# Altium schematic sheet LPCB235 - RM48 - OVERVIEW.SchDoc
size A3; Address1: Unit 4; DocumentNumber: 21; Revision: 2; SheetNumber: 21; SheetTotal: 37; Lockie__PCB_SUB_ASSEMBLY: CPU Overview; Lockie__PCB_ASSEMBLY: FCU PCB; Lockie__LDL: LPCB235; Lockie__PCB_DESCRIPTION: Flight Control Unit
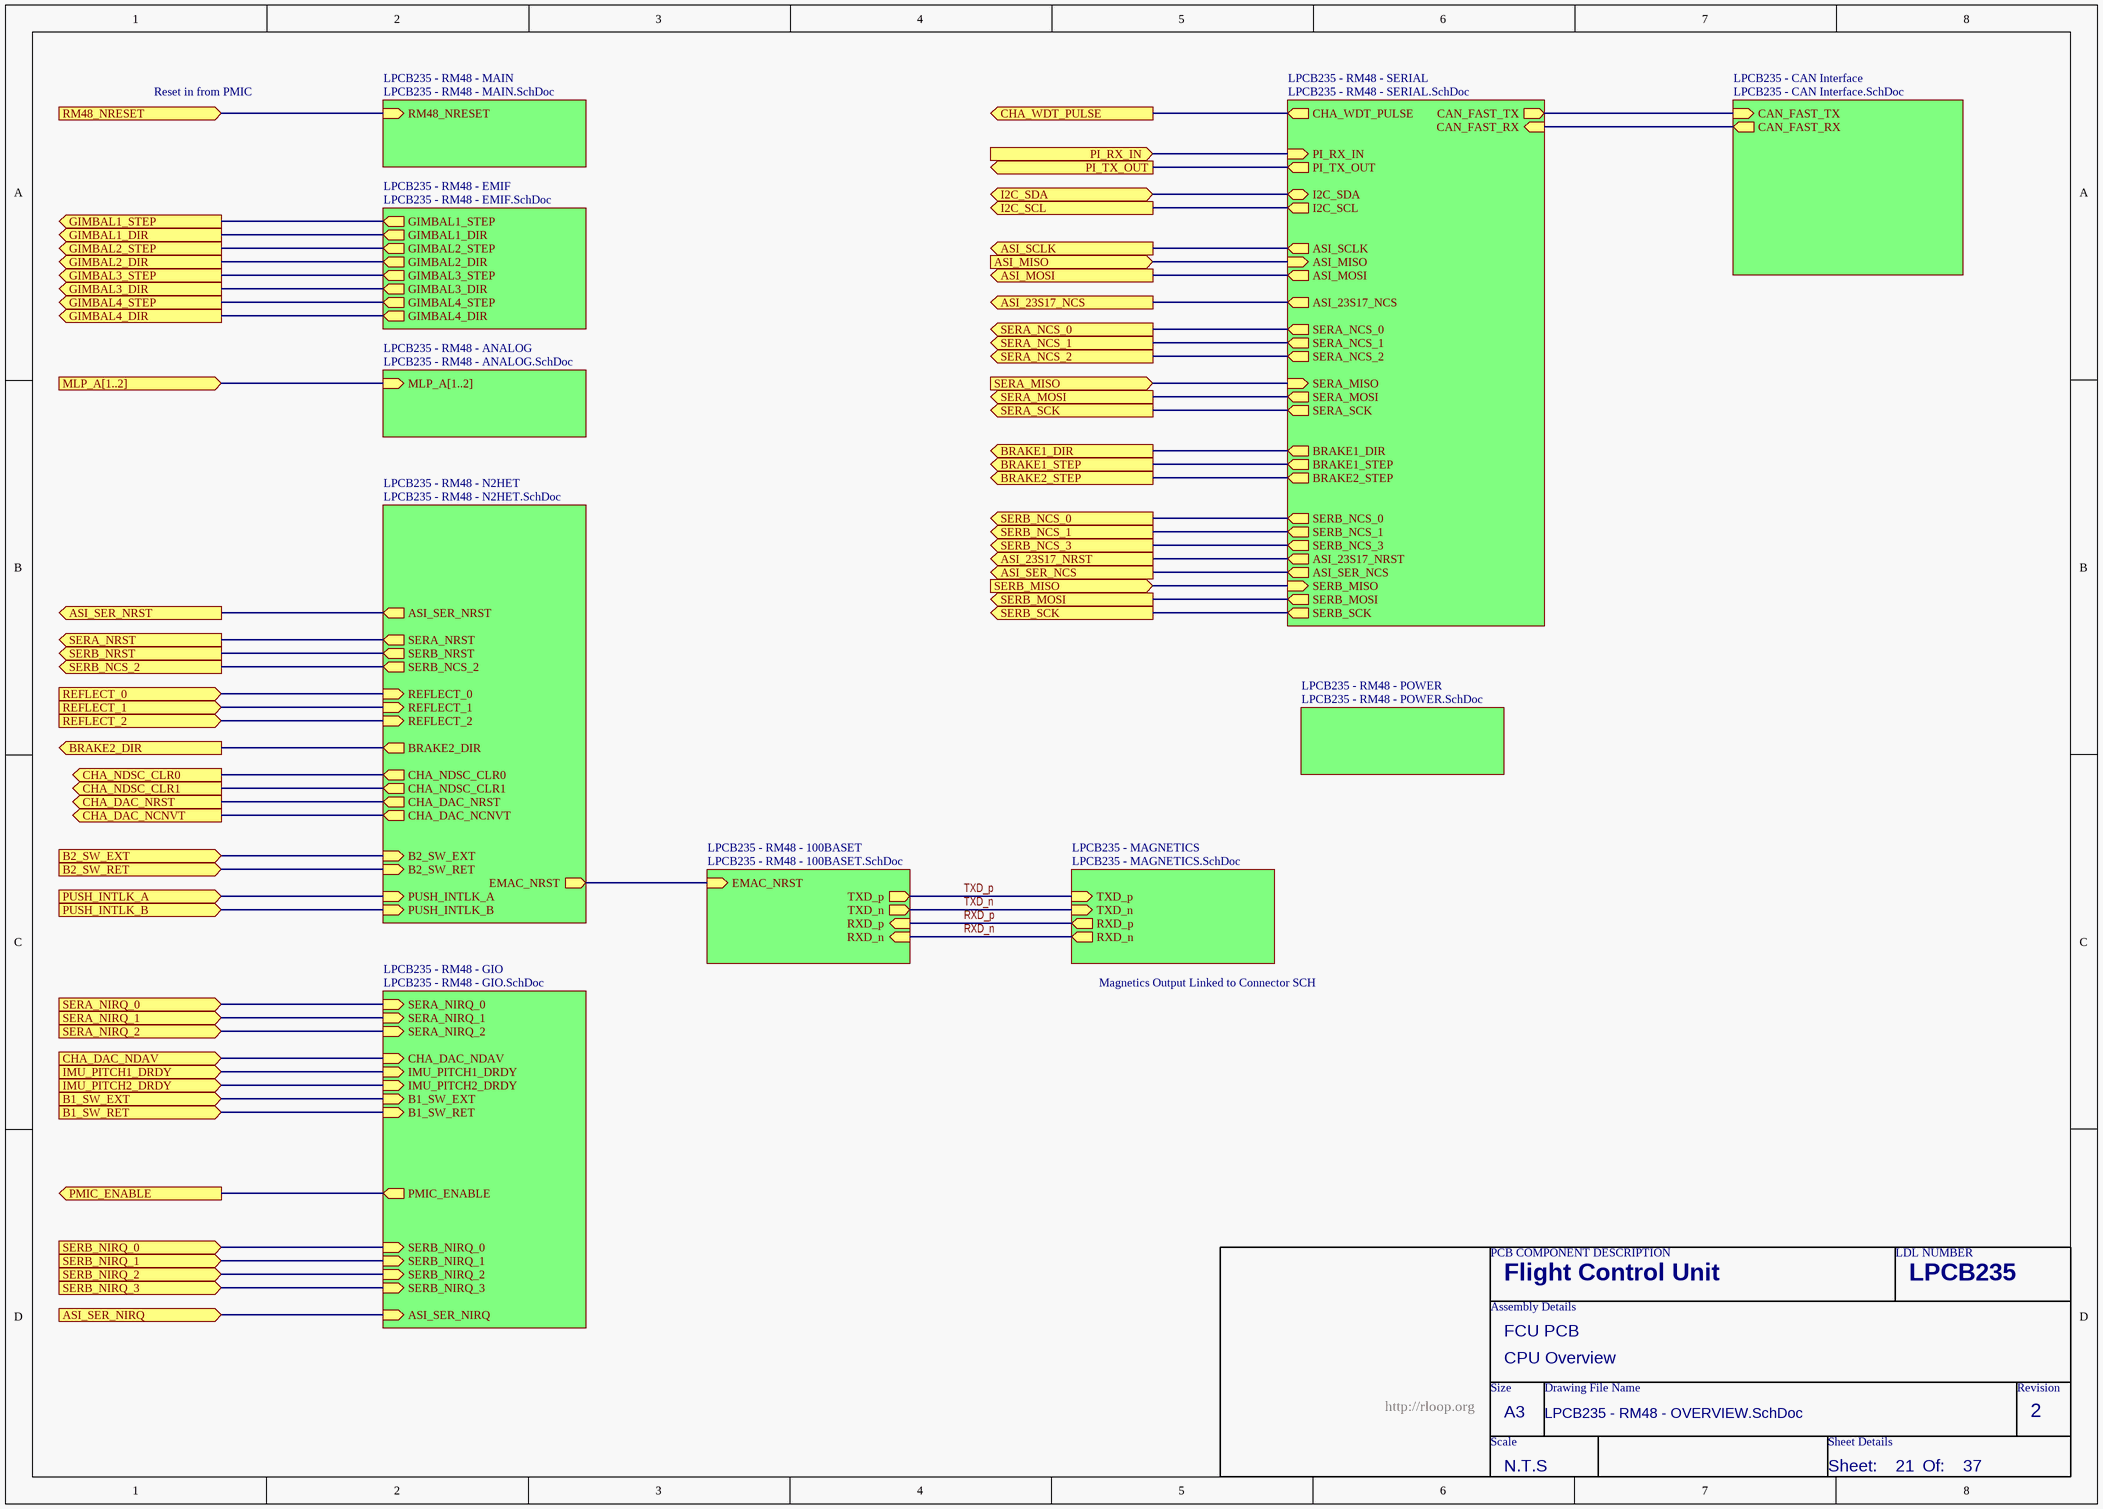
[diagram p0: LPCB235 - RM48 - OVERVIEW.SchDoc]

## Sub-sheets
LPCB235 - CAN Interface = LPCB235 - CAN Interface.SchDoc: CAN_FAST_TX (in), CAN_FAST_RX (out)
LPCB235 - MAGNETICS = LPCB235 - MAGNETICS.SchDoc: TXD_p (in), TXD_n (in), RXD_p (out), RXD_n (out)
LPCB235 - RM48 - 100BASET = LPCB235 - RM48 - 100BASET.SchDoc: TXD_p (out), TXD_n (out), RXD_p (in), RXD_n (in), EMAC_NRST (in)
LPCB235 - RM48 - ANALOG = LPCB235 - RM48 - ANALOG.SchDoc: MLP_A[1..2] (in)
LPCB235 - RM48 - EMIF = LPCB235 - RM48 - EMIF.SchDoc: GIMBAL1_STEP (out), GIMBAL1_DIR (out), GIMBAL2_STEP (out), GIMBAL2_DIR (out), GIMBAL3_STEP (out), GIMBAL3_DIR (out), GIMBAL4_STEP (out), GIMBAL4_DIR (out)
LPCB235 - RM48 - GIO = LPCB235 - RM48 - GIO.SchDoc: SERA_NIRQ_0 (in), SERA_NIRQ_1 (in), SERA_NIRQ_2 (in), IMU_PITCH1_DRDY (in), CHA_DAC_NDAV (in), IMU_PITCH2_DRDY (in), PMIC_ENABLE (out), B1_SW_EXT (in), B1_SW_RET (in), SERB_NIRQ_0 (in), SERB_NIRQ_1 (in), SERB_NIRQ_2 (in), SERB_NIRQ_3 (in), ASI_SER_NIRQ (in)
LPCB235 - RM48 - MAIN = LPCB235 - RM48 - MAIN.SchDoc: RM48_NRESET (in)
LPCB235 - RM48 - N2HET = LPCB235 - RM48 - N2HET.SchDoc: SERA_NRST (out), SERB_NRST (out), REFLECT_0 (in), REFLECT_1 (in), REFLECT_2 (in), BRAKE2_DIR (out), PUSH_INTLK_A (in), EMAC_NRST (out), B2_SW_EXT (in), SERB_NCS_2 (out), PUSH_INTLK_B (in), B2_SW_RET (in), CHA_NDSC_CLR0 (out), CHA_NDSC_CLR1 (out), CHA_DAC_NRST (out), CHA_DAC_NCNVT (out), ASI_SER_NRST (out)
LPCB235 - RM48 - POWER = LPCB235 - RM48 - POWER.SchDoc: no entries
LPCB235 - RM48 - SERIAL = LPCB235 - RM48 - SERIAL.SchDoc: CAN_FAST_TX (out), CAN_FAST_RX (in), ASI_SCLK (out), ASI_MOSI (out), ASI_MISO (in), CHA_WDT_PULSE (out), SERA_SCK (out), SERA_MOSI (out), SERA_MISO (in), SERA_NCS_0 (out), SERA_NCS_1 (out), SERA_NCS_2 (out), SERB_MISO (in), SERB_MOSI (out), SERB_SCK (out), BRAKE2_STEP (out), BRAKE1_STEP (out), BRAKE1_DIR (out), SERB_NCS_0 (out), SERB_NCS_1 (out), I2C_SDA (bidir), I2C_SCL (out), SERB_NCS_3 (out), ASI_23S17_NRST (out), ASI_SER_NCS (out), PI_RX_IN (in), PI_TX_OUT (out), ASI_23S17_NCS (out)

## Ports
ASI_23S17_NCS (out), ASI_23S17_NRST (out), ASI_MISO (in), ASI_MOSI (out), ASI_SCLK (out), ASI_SER_NCS (out), ASI_SER_NIRQ (in), ASI_SER_NRST (out), B1_SW_EXT (in), B1_SW_RET (in), B2_SW_EXT (in), B2_SW_RET (in), BRAKE1_DIR (out), BRAKE1_STEP (out), BRAKE2_DIR (out), BRAKE2_STEP (out), CHA_DAC_NCNVT (out), CHA_DAC_NDAV (in), CHA_DAC_NRST (out), CHA_NDSC_CLR0 (out), CHA_NDSC_CLR1 (out), CHA_WDT_PULSE (out), GIMBAL1_DIR (out), GIMBAL1_STEP (out), GIMBAL2_DIR (out), GIMBAL2_STEP (out), GIMBAL3_DIR (out), GIMBAL3_STEP (out), GIMBAL4_DIR (out), GIMBAL4_STEP (out), I2C_SCL (out), I2C_SDA (bidir), IMU_PITCH1_DRDY (in), IMU_PITCH2_DRDY (in), MLP_A[1..2] (in), PI_RX_IN (in), PI_TX_OUT (out), PMIC_ENABLE (out), PUSH_INTLK_A (in), PUSH_INTLK_B (in), REFLECT_0 (in), REFLECT_1 (in), REFLECT_2 (in), RM48_NRESET (in), SERA_MISO (in), SERA_MOSI (out), SERA_NCS_0 (out), SERA_NCS_1 (out), SERA_NCS_2 (out), SERA_NIRQ_0 (in), SERA_NIRQ_1 (in), SERA_NIRQ_2 (in), SERA_NRST (out), SERA_SCK (out), SERB_MISO (in), SERB_MOSI (out), SERB_NCS_0 (out), SERB_NCS_1 (out), SERB_NCS_2 (out), SERB_NCS_3 (out), SERB_NIRQ_0 (in), SERB_NIRQ_1 (in), SERB_NIRQ_2 (in), SERB_NIRQ_3 (in), SERB_NRST (out), SERB_SCK (out)

## Nets
ASI_23S17_NCS: port ASI_23S17_NCS, sheet LPCB235 - RM48 - SERIAL/ASI_23S17_NCS
ASI_23S17_NRST: port ASI_23S17_NRST, sheet LPCB235 - RM48 - SERIAL/ASI_23S17_NRST
ASI_MISO: port ASI_MISO, sheet LPCB235 - RM48 - SERIAL/ASI_MISO
ASI_MOSI: port ASI_MOSI, sheet LPCB235 - RM48 - SERIAL/ASI_MOSI
ASI_SCLK: port ASI_SCLK, sheet LPCB235 - RM48 - SERIAL/ASI_SCLK
ASI_SER_NCS: port ASI_SER_NCS, sheet LPCB235 - RM48 - SERIAL/ASI_SER_NCS
ASI_SER_NIRQ: port ASI_SER_NIRQ, sheet LPCB235 - RM48 - GIO/ASI_SER_NIRQ
ASI_SER_NRST: port ASI_SER_NRST, sheet LPCB235 - RM48 - N2HET/ASI_SER_NRST
B1_SW_EXT: port B1_SW_EXT, sheet LPCB235 - RM48 - GIO/B1_SW_EXT
B1_SW_RET: port B1_SW_RET, sheet LPCB235 - RM48 - GIO/B1_SW_RET
B2_SW_EXT: port B2_SW_EXT, sheet LPCB235 - RM48 - N2HET/B2_SW_EXT
B2_SW_RET: port B2_SW_RET, sheet LPCB235 - RM48 - N2HET/B2_SW_RET
BRAKE1_DIR: port BRAKE1_DIR, sheet LPCB235 - RM48 - SERIAL/BRAKE1_DIR
BRAKE1_STEP: port BRAKE1_STEP, sheet LPCB235 - RM48 - SERIAL/BRAKE1_STEP
BRAKE2_DIR: port BRAKE2_DIR, sheet LPCB235 - RM48 - N2HET/BRAKE2_DIR
BRAKE2_STEP: port BRAKE2_STEP, sheet LPCB235 - RM48 - SERIAL/BRAKE2_STEP
CHA_DAC_NCNVT: port CHA_DAC_NCNVT, sheet LPCB235 - RM48 - N2HET/CHA_DAC_NCNVT
CHA_DAC_NDAV: port CHA_DAC_NDAV, sheet LPCB235 - RM48 - GIO/CHA_DAC_NDAV
CHA_DAC_NRST: port CHA_DAC_NRST, sheet LPCB235 - RM48 - N2HET/CHA_DAC_NRST
CHA_NDSC_CLR0: port CHA_NDSC_CLR0, sheet LPCB235 - RM48 - N2HET/CHA_NDSC_CLR0
CHA_NDSC_CLR1: port CHA_NDSC_CLR1, sheet LPCB235 - RM48 - N2HET/CHA_NDSC_CLR1
CHA_WDT_PULSE: port CHA_WDT_PULSE, sheet LPCB235 - RM48 - SERIAL/CHA_WDT_PULSE
GIMBAL1_DIR: port GIMBAL1_DIR, sheet LPCB235 - RM48 - EMIF/GIMBAL1_DIR
GIMBAL1_STEP: port GIMBAL1_STEP, sheet LPCB235 - RM48 - EMIF/GIMBAL1_STEP
GIMBAL2_DIR: port GIMBAL2_DIR, sheet LPCB235 - RM48 - EMIF/GIMBAL2_DIR
GIMBAL2_STEP: port GIMBAL2_STEP, sheet LPCB235 - RM48 - EMIF/GIMBAL2_STEP
GIMBAL3_DIR: port GIMBAL3_DIR, sheet LPCB235 - RM48 - EMIF/GIMBAL3_DIR
GIMBAL3_STEP: port GIMBAL3_STEP, sheet LPCB235 - RM48 - EMIF/GIMBAL3_STEP
GIMBAL4_DIR: port GIMBAL4_DIR, sheet LPCB235 - RM48 - EMIF/GIMBAL4_DIR
GIMBAL4_STEP: port GIMBAL4_STEP, sheet LPCB235 - RM48 - EMIF/GIMBAL4_STEP
I2C_SCL: port I2C_SCL, sheet LPCB235 - RM48 - SERIAL/I2C_SCL
I2C_SDA: port I2C_SDA, sheet LPCB235 - RM48 - SERIAL/I2C_SDA
IMU_PITCH1_DRDY: port IMU_PITCH1_DRDY, sheet LPCB235 - RM48 - GIO/IMU_PITCH1_DRDY
IMU_PITCH2_DRDY: port IMU_PITCH2_DRDY, sheet LPCB235 - RM48 - GIO/IMU_PITCH2_DRDY
PI_RX_IN: port PI_RX_IN, sheet LPCB235 - RM48 - SERIAL/PI_RX_IN
PI_TX_OUT: port PI_TX_OUT, sheet LPCB235 - RM48 - SERIAL/PI_TX_OUT
PMIC_ENABLE: port PMIC_ENABLE, sheet LPCB235 - RM48 - GIO/PMIC_ENABLE
PUSH_INTLK_A: port PUSH_INTLK_A, sheet LPCB235 - RM48 - N2HET/PUSH_INTLK_A
PUSH_INTLK_B: port PUSH_INTLK_B, sheet LPCB235 - RM48 - N2HET/PUSH_INTLK_B
REFLECT_0: port REFLECT_0, sheet LPCB235 - RM48 - N2HET/REFLECT_0
REFLECT_1: port REFLECT_1, sheet LPCB235 - RM48 - N2HET/REFLECT_1
REFLECT_2: port REFLECT_2, sheet LPCB235 - RM48 - N2HET/REFLECT_2
RM48_NRESET: port RM48_NRESET, sheet LPCB235 - RM48 - MAIN/RM48_NRESET
RXD_n: sheet LPCB235 - RM48 - 100BASET/RXD_n, sheet LPCB235 - MAGNETICS/RXD_n
RXD_p: sheet LPCB235 - RM48 - 100BASET/RXD_p, sheet LPCB235 - MAGNETICS/RXD_p
SERA_MISO: port SERA_MISO, sheet LPCB235 - RM48 - SERIAL/SERA_MISO
SERA_MOSI: port SERA_MOSI, sheet LPCB235 - RM48 - SERIAL/SERA_MOSI
SERA_NCS_0: port SERA_NCS_0, sheet LPCB235 - RM48 - SERIAL/SERA_NCS_0
SERA_NCS_1: port SERA_NCS_1, sheet LPCB235 - RM48 - SERIAL/SERA_NCS_1
SERA_NCS_2: port SERA_NCS_2, sheet LPCB235 - RM48 - SERIAL/SERA_NCS_2
SERA_NIRQ_0: port SERA_NIRQ_0, sheet LPCB235 - RM48 - GIO/SERA_NIRQ_0
SERA_NIRQ_1: port SERA_NIRQ_1, sheet LPCB235 - RM48 - GIO/SERA_NIRQ_1
SERA_NIRQ_2: port SERA_NIRQ_2, sheet LPCB235 - RM48 - GIO/SERA_NIRQ_2
SERA_NRST: port SERA_NRST, sheet LPCB235 - RM48 - N2HET/SERA_NRST
SERA_SCK: port SERA_SCK, sheet LPCB235 - RM48 - SERIAL/SERA_SCK
SERB_MISO: port SERB_MISO, sheet LPCB235 - RM48 - SERIAL/SERB_MISO
SERB_MOSI: port SERB_MOSI, sheet LPCB235 - RM48 - SERIAL/SERB_MOSI
SERB_NCS_0: port SERB_NCS_0, sheet LPCB235 - RM48 - SERIAL/SERB_NCS_0
SERB_NCS_1: port SERB_NCS_1, sheet LPCB235 - RM48 - SERIAL/SERB_NCS_1
SERB_NCS_2: port SERB_NCS_2, sheet LPCB235 - RM48 - N2HET/SERB_NCS_2
SERB_NCS_3: port SERB_NCS_3, sheet LPCB235 - RM48 - SERIAL/SERB_NCS_3
SERB_NIRQ_0: port SERB_NIRQ_0, sheet LPCB235 - RM48 - GIO/SERB_NIRQ_0
SERB_NIRQ_1: port SERB_NIRQ_1, sheet LPCB235 - RM48 - GIO/SERB_NIRQ_1
SERB_NIRQ_2: port SERB_NIRQ_2, sheet LPCB235 - RM48 - GIO/SERB_NIRQ_2
SERB_NIRQ_3: port SERB_NIRQ_3, sheet LPCB235 - RM48 - GIO/SERB_NIRQ_3
SERB_NRST: port SERB_NRST, sheet LPCB235 - RM48 - N2HET/SERB_NRST
SERB_SCK: port SERB_SCK, sheet LPCB235 - RM48 - SERIAL/SERB_SCK
TXD_n: sheet LPCB235 - RM48 - 100BASET/TXD_n, sheet LPCB235 - MAGNETICS/TXD_n
TXD_p: sheet LPCB235 - RM48 - 100BASET/TXD_p, sheet LPCB235 - MAGNETICS/TXD_p
(unnamed): sheet LPCB235 - CAN Interface/CAN_FAST_TX, sheet LPCB235 - RM48 - SERIAL/CAN_FAST_TX
(unnamed): sheet LPCB235 - CAN Interface/CAN_FAST_RX, sheet LPCB235 - RM48 - SERIAL/CAN_FAST_RX
(unnamed): sheet LPCB235 - RM48 - 100BASET/EMAC_NRST, sheet LPCB235 - RM48 - N2HET/EMAC_NRST

## Buses and harness runs
bus port MLP_A[1..2] = sheet LPCB235 - RM48 - ANALOG/MLP_A[1..2]

## Notes on the sheet
- Reset in from PMIC
- Magnetics Output Linked to Connector SCH
- PCB COMPONENT DESCRIPTION
- LDL NUMBER
- Assembly Details
- Size
- Drawing File Name
- Revision
- http://rloop.org
- Scale
- A3
- Sheet Details
- N.T.S
- Sheet:
- Of: